# EAGLE design flatsat (EAGLE 7.2.0)
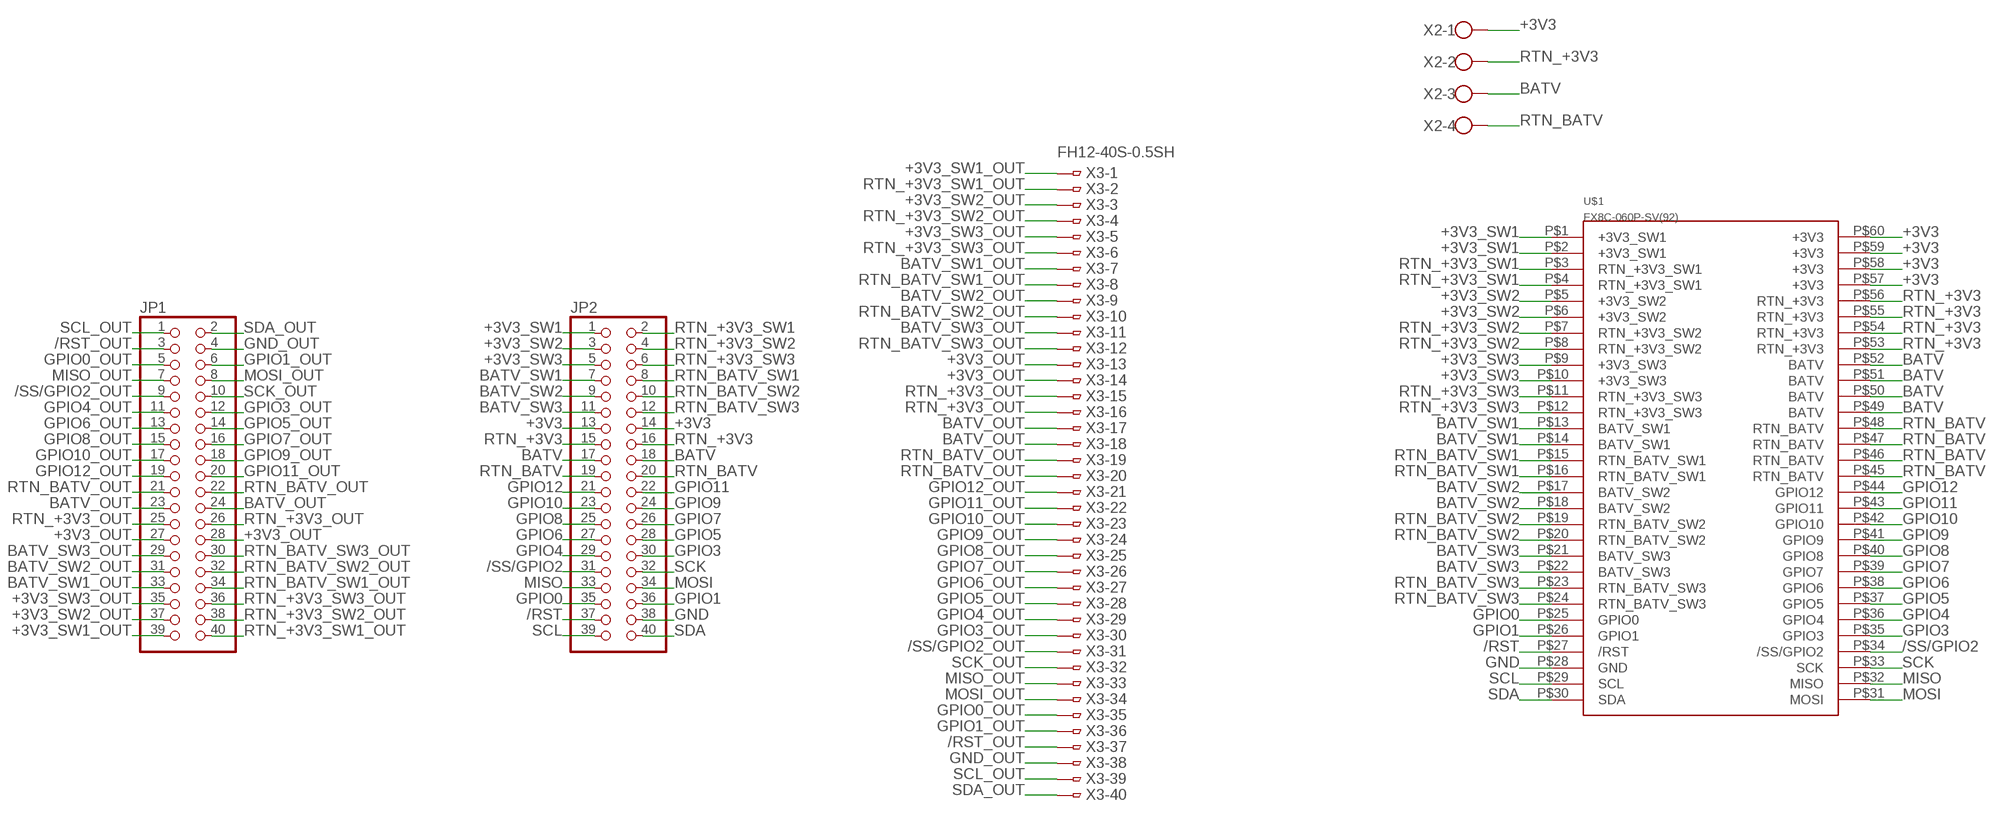
[diagram p0: schematic, sheet 1]

## Parts
JP1  PINHD-2X20/90  [2X20/90]
JP2  PINHD-2X20/90  [2X20/90]
U$1  FX8C-060P-SV(92)  [FX8C-060P-SV(92)]
X2  W237-4  [W237-4]
X3  FH12-40S-0.5SH  [FH12-40S-0.5SH]

## Nets
+3V3: JP2.13 JP2.14 U$1.P$57(+3V3) U$1.P$58(+3V3) U$1.P$59(+3V3) U$1.P$60(+3V3) X2.1
+3V3_OUT: JP1.27 JP1.28 X3.13 X3.14
+3V3_SW1: JP2.1 U$1.P$1(+3V3_SW1) U$1.P$2(+3V3_SW1)
+3V3_SW1_OUT: JP1.39 X3.1
+3V3_SW2: JP2.3 U$1.P$5(+3V3_SW2) U$1.P$6(+3V3_SW2)
+3V3_SW2_OUT: JP1.37 X3.3
+3V3_SW3: JP2.5 U$1.P$9(+3V3_SW3) U$1.P$10(+3V3_SW3)
+3V3_SW3_OUT: JP1.35 X3.5
/RST: JP2.37 U$1.P$27(/RST)
/RST_OUT: JP1.3 X3.37
/SS/GPIO2: JP2.31 U$1.P$34(/SS/GPIO2)
/SS/GPIO2_OUT: JP1.9 X3.31
BATV: JP2.17 JP2.18 U$1.P$49(BATV) U$1.P$50(BATV) U$1.P$51(BATV) U$1.P$52(BATV) X2.3
BATV_OUT: JP1.23 JP1.24 X3.17 X3.18
BATV_SW1: JP2.7 U$1.P$13(BATV_SW1) U$1.P$14(BATV_SW1)
BATV_SW1_OUT: JP1.33 X3.7
BATV_SW2: JP2.9 U$1.P$17(BATV_SW2) U$1.P$18(BATV_SW2)
BATV_SW2_OUT: JP1.31 X3.9
BATV_SW3: JP2.11 U$1.P$21(BATV_SW3) U$1.P$22(BATV_SW3)
BATV_SW3_OUT: JP1.29 X3.11
GND: JP2.38 U$1.P$28(GND)
GND_OUT: JP1.4 X3.38
GPIO0: JP2.35 U$1.P$25(GPIO0)
GPIO0_OUT: JP1.5 X3.35
GPIO1: JP2.36 U$1.P$26(GPIO1)
GPIO1_OUT: JP1.6 X3.36
GPIO3: JP2.30 U$1.P$35(GPIO3)
GPIO3_OUT: JP1.12 X3.30
GPIO4: JP2.29 U$1.P$36(GPIO4)
GPIO4_OUT: JP1.11 X3.29
GPIO5: JP2.28 U$1.P$37(GPIO5)
GPIO5_OUT: JP1.14 X3.28
GPIO6: JP2.27 U$1.P$38(GPIO6)
GPIO6_OUT: JP1.13 X3.27
GPIO7: JP2.26 U$1.P$39(GPIO7)
GPIO7_OUT: JP1.16 X3.26
GPIO8: JP2.25 U$1.P$40(GPIO8)
GPIO8_OUT: JP1.15 X3.25
GPIO9: JP2.24 U$1.P$41(GPIO9)
GPIO9_OUT: JP1.18 X3.24
GPIO10: JP2.23 U$1.P$42(GPIO10)
GPIO10_OUT: JP1.17 X3.23
GPIO11: JP2.22 U$1.P$43(GPIO11)
GPIO11_OUT: JP1.20 X3.22
GPIO12: JP2.21 U$1.P$44(GPIO12)
GPIO12_OUT: JP1.19 X3.21
MISO: JP2.33 U$1.P$32(MISO)
MISO_OUT: JP1.7 X3.33
MOSI: JP2.34 U$1.P$31(MOSI)
MOSI_OUT: JP1.8 X3.34
RTN_+3V3: JP2.15 JP2.16 U$1.P$53(RTN_+3V3) U$1.P$54(RTN_+3V3) U$1.P$55(RTN_+3V3) U$1.P$56(RTN_+3V3) X2.2
RTN_+3V3_OUT: JP1.25 JP1.26 X3.15 X3.16
RTN_+3V3_SW1: JP2.2 U$1.P$3(RTN_+3V3_SW1) U$1.P$4(RTN_+3V3_SW1)
RTN_+3V3_SW1_OUT: JP1.40 X3.2
RTN_+3V3_SW2: JP2.4 U$1.P$7(RTN_+3V3_SW2) U$1.P$8(RTN_+3V3_SW2)
RTN_+3V3_SW2_OUT: JP1.38 X3.4
RTN_+3V3_SW3: JP2.6 U$1.P$11(RTN_+3V3_SW3) U$1.P$12(RTN_+3V3_SW3)
RTN_+3V3_SW3_OUT: JP1.36 X3.6
RTN_BATV: JP2.19 JP2.20 U$1.P$45(RTN_BATV) U$1.P$46(RTN_BATV) U$1.P$47(RTN_BATV) U$1.P$48(RTN_BATV) X2.4
RTN_BATV_OUT: JP1.21 JP1.22 X3.19 X3.20
RTN_BATV_SW1: JP2.8 U$1.P$15(RTN_BATV_SW1) U$1.P$16(RTN_BATV_SW1)
RTN_BATV_SW1_OUT: JP1.34 X3.8
RTN_BATV_SW2: JP2.10 U$1.P$19(RTN_BATV_SW2) U$1.P$20(RTN_BATV_SW2)
RTN_BATV_SW2_OUT: JP1.32 X3.10
RTN_BATV_SW3: JP2.12 U$1.P$23(RTN_BATV_SW3) U$1.P$24(RTN_BATV_SW3)
RTN_BATV_SW3_OUT: JP1.30 X3.12
SCK: JP2.32 U$1.P$33(SCK)
SCK_OUT: JP1.10 X3.32
SCL: JP2.39 U$1.P$29(SCL)
SCL_OUT: JP1.1 X3.39
SDA: JP2.40 U$1.P$30(SDA)
SDA_OUT: JP1.2 X3.40

## Library data of the parts
JP1 JP2 = pinhead:PINHD-2X20: PIN HEADER
U$1 = Template:FX8C-060P-SV(92)
X2 = con-wago-500:W237-4: WAGO SCREW CLAMP; OC_FARNELL: unknown; OC_NEWARK: unknown
X3 = con-hirose:FH12-40S-0.5S: 0.5mm Pitch Connectors For FPC/FFC Source: Data sheet <http://www.hirose.co.jp/cataloge_hp/e58605370.pdf>; MPN: FH12-40S-0.5SH(55); OC_FARNELL: 1324556; OC_NEWARK: 34M6178

## Board
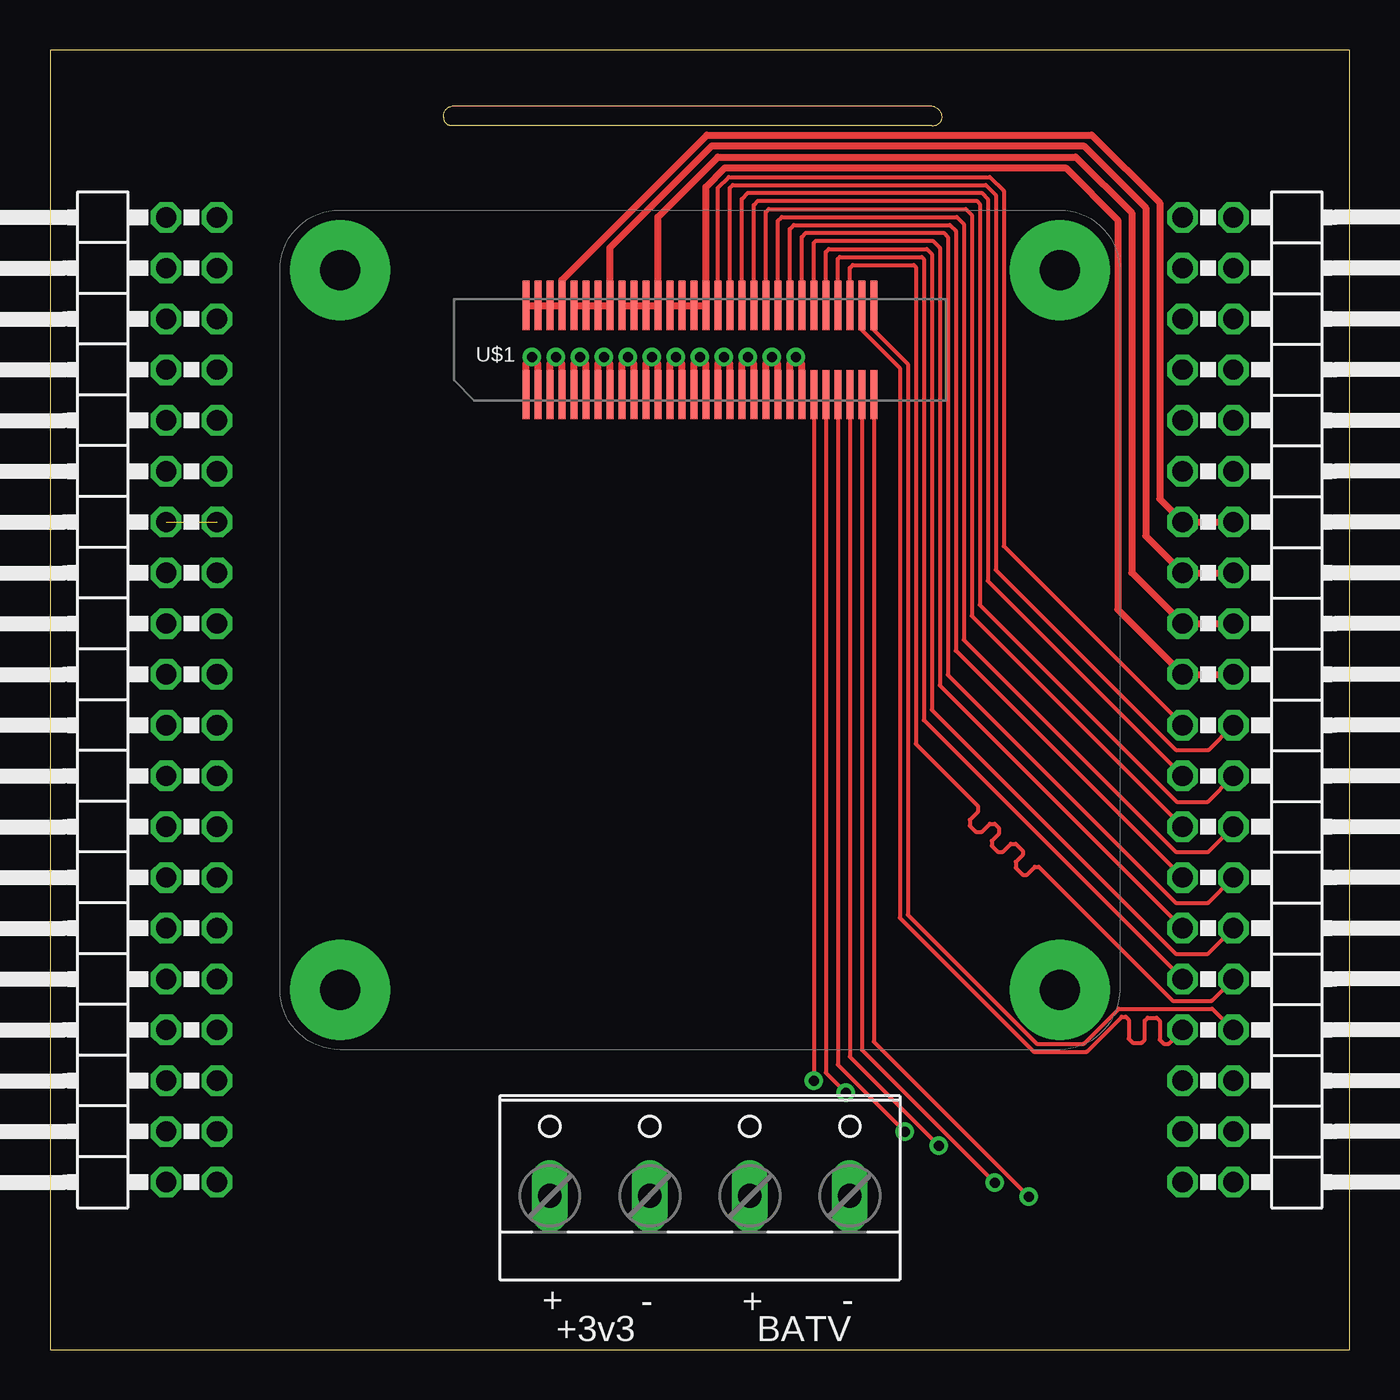
[diagram p1: board, top side]
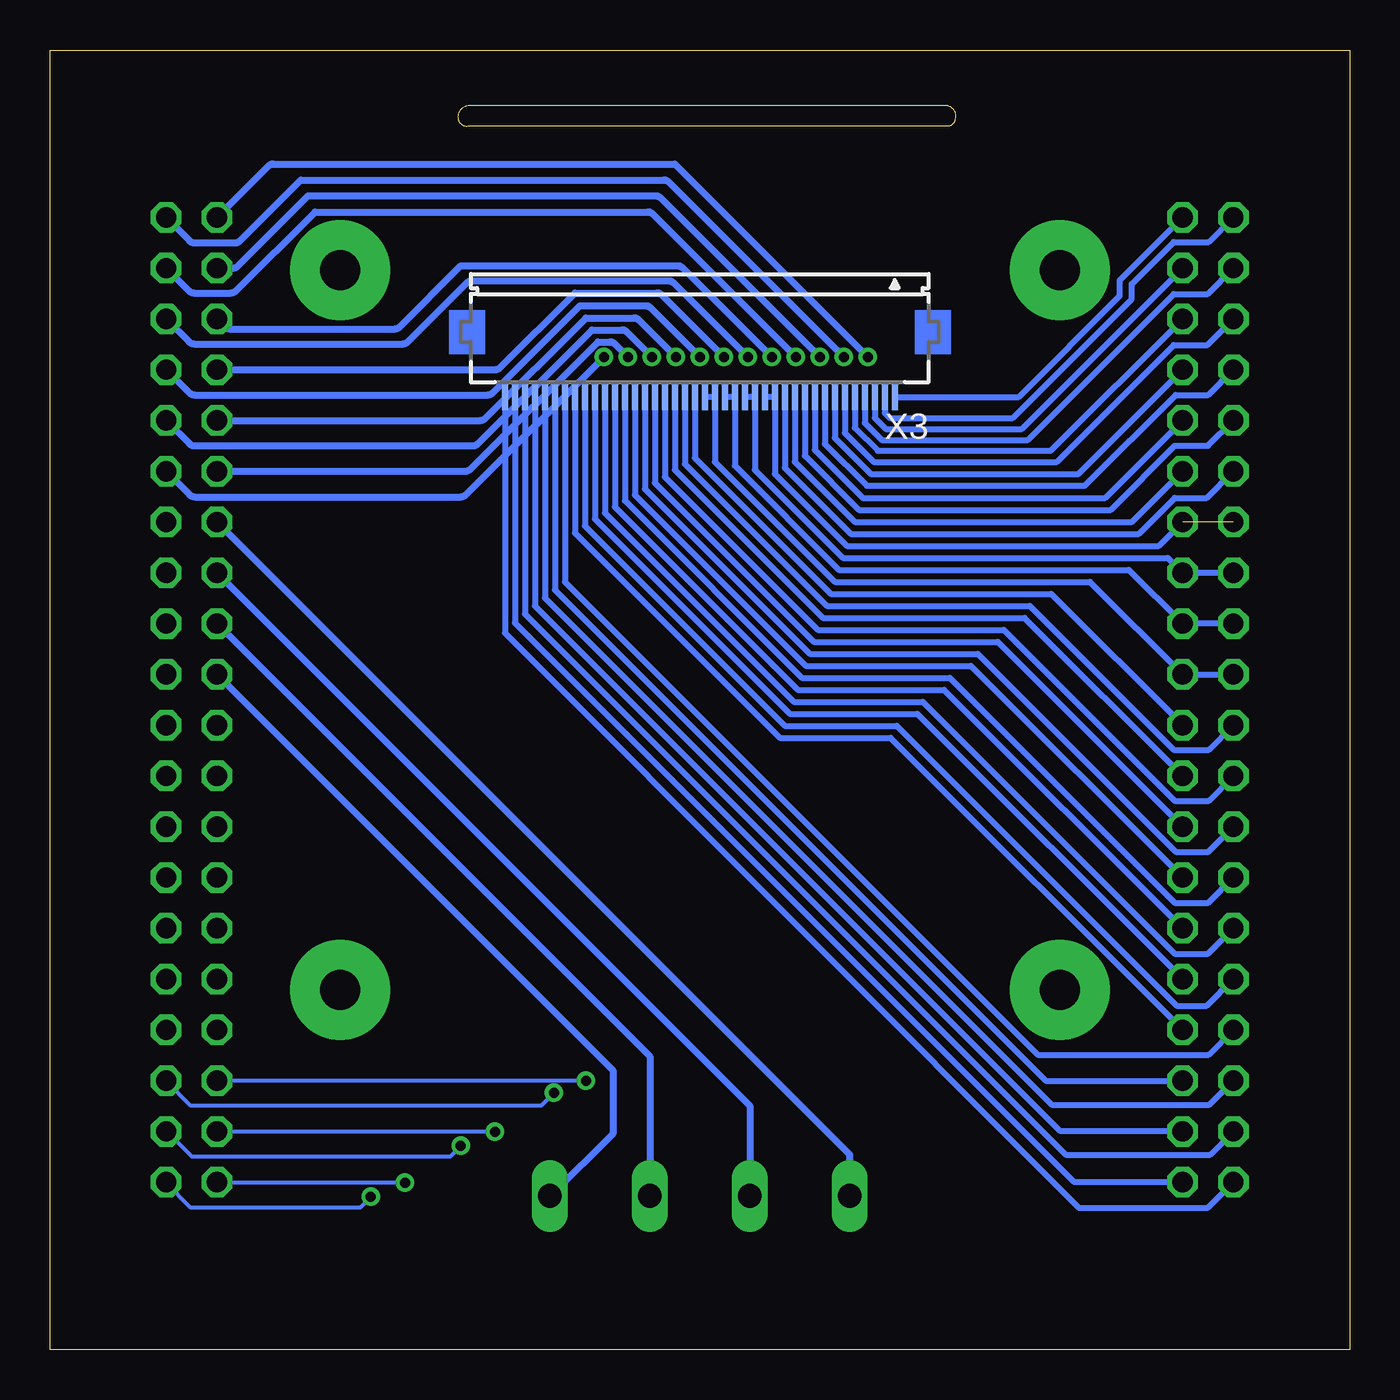
[diagram p2: board, bottom side, seen from below]

Size 65 x 65 mm. Coordinates in mm from the lower left corner, seen from the top.
Outline: 0,0 65,0 65,65 0,65 0,0
Outline: 19.7,61.6 arc-90 20.1,62.2 44.1,62.2 arc-90 44.6,61.6 arc-90 44.1,61.2 20.1,61.2 arc-90 19.7,61.6
Copper layers (1*16): Top 0.035mm / dielectric 1.5mm / Bottom 0.035mm
Design rules "default *": minimum track width 6mil, minimum drill 0.5mm, track to track 6mil, track to pad 6mil, pad to pad 6mil, via to via 6mil, smd to smd 6mil, copper to edge 6mil, drill to drill 6mil, minimum pad ring 10mil, minimum via ring 8mil, stop-mask expansion 4mil, vias tented up to drill 0mil, thermal gap 10mil

### Footprints (pad centres in the part's own frame; a part is rotated, then mirrored left to right if it is on the bottom)
2X20/90 = drill 1.016 octagon: 1 -24.13,-6.35; 2 -24.13,-3.81; 3 -21.59,-6.35; 4 -21.59,-3.81; 5 -19.05,-6.35; 6 -19.05,-3.81; 7 -16.51,-6.35; 8 -16.51,-3.81; 9 -13.97,-6.35; 10 -13.97,-3.81; 11 -11.43,-6.35; 12 -11.43,-3.81; 13 -8.89,-6.35; 14 -8.89,-3.81; 15 -6.35,-6.35; 16 -6.35,-3.81; 17 -3.81,-6.35; 18 -3.81,-3.81; 19 -1.27,-6.35; 20 -1.27,-3.81; 21 1.27,-6.35; 22 1.27,-3.81; 23 3.81,-6.35; 24 3.81,-3.81; 25 6.35,-6.35; 26 6.35,-3.81; 27 8.89,-6.35; 28 8.89,-3.81; 29 11.43,-6.35; 30 11.43,-3.81; 31 13.97,-6.35; 32 13.97,-3.81; 33 16.51,-6.35; 34 16.51,-3.81; 35 19.05,-6.35; 36 19.05,-3.81; 37 21.59,-6.35; 38 21.59,-3.81; 39 24.13,-6.35; 40 24.13,-3.81
FX8C-060P-SV(92) = smd 0.35 x 2.45: P$1 -8.7,-2.225; P$2 -8.1,-2.225; P$3 -7.5,-2.225; P$4 -6.9,-2.225; P$5 -6.3,-2.225; P$6 -5.7,-2.225; P$7 -5.1,-2.225; P$8 -4.5,-2.225; P$9 -3.9,-2.225; P$10 -3.3,-2.225; P$11 -2.7,-2.225; P$12 -2.1,-2.225; P$13 -1.5,-2.225; P$14 -0.9,-2.225; P$15 -0.3,-2.225; P$16 0.3,-2.225; P$17 0.9,-2.225; P$18 1.5,-2.225; P$19 2.1,-2.225; P$20 2.7,-2.225; P$21 3.3,-2.225; P$22 3.9,-2.225; P$23 4.5,-2.225; P$24 5.1,-2.225; P$25 5.7,-2.225; P$26 6.3,-2.225; P$27 6.9,-2.225; P$28 7.5,-2.225; P$29 8.1,-2.225; P$30 8.7,-2.225; P$31 8.7,2.225; P$32 8.1,2.225; P$33 7.5,2.225; P$34 6.9,2.225; P$35 6.3,2.225; P$36 5.7,2.225; P$37 5.1,2.225; P$38 4.5,2.225; P$39 3.9,2.225; P$40 3.3,2.225; P$41 2.7,2.225; P$42 2.1,2.225; P$43 1.5,2.225; P$44 0.9,2.225; P$45 0.3,2.225; P$46 -0.3,2.225; P$47 -0.9,2.225; P$48 -1.5,2.225; P$49 -2.1,2.225; P$50 -2.7,2.225; P$51 -3.3,2.225; P$52 -3.9,2.225; P$53 -4.5,2.225; P$54 -5.1,2.225; P$55 -5.7,2.225; P$56 -6.3,2.225; P$57 -6.9,2.225; P$58 -7.5,2.225; P$59 -8.1,2.225; P$60 -8.7,2.225
W237-4 = drill 1.194 long: 1 -7.5,-1.27; 2 -2.5,-1.27; 3 2.5,-1.27; 4 7.5,-1.27
FH12-40S-0.5SH = smd 0.3 x 1.3: 1 -9.75,3.25; 2 -9.25,3.25; 3 -8.75,3.25; 4 -8.25,3.25; 5 -7.75,3.25; 6 -7.25,3.25; 7 -6.75,3.25; 8 -6.25,3.25; 9 -5.75,3.25; 10 -5.25,3.25; 11 -4.75,3.25; 12 -4.25,3.25; 13 -3.75,3.25; 14 -3.25,3.25; 15 -2.75,3.25; 16 -2.25,3.25; 17 -1.75,3.25; 18 -1.25,3.25; 19 -0.75,3.25; 20 -0.25,3.25; 21 0.25,3.25; 22 0.75,3.25; 23 1.25,3.25; 24 1.75,3.25; 25 2.25,3.25; 26 2.75,3.25; 27 3.25,3.25; 28 3.75,3.25; 29 4.25,3.25; 30 4.75,3.25; 31 5.25,3.25; 32 5.75,3.25; 33 6.25,3.25; 34 6.75,3.25; 35 7.25,3.25; 36 7.75,3.25; 37 8.25,3.25; 38 8.75,3.25; 39 9.25,3.25; 40 9.75,3.25

### Placement (x,y rotation side)
JP1  2,32.5 90 top
JP2  63,32.5 270 top
U$1  32.5,50 0 top
X2  32.5,8.95 0 top
X3  32.5,50.9 180 bottom

### Tracks (layer width: path | path; a pad name or v marks a point on that pad's centre or on a via)
+3V3
  Top 0.35: U$1.P$60 U$1.P$59 U$1.P$58 U$1.P$57 25.6,53.5 32.85,60.75 52.1,60.75 55.5,57.35 55.5,42.54 JP2.13 JP2.14
  Bottom 0.35: X2.1 25,9.74 JP2.13
+3V3_OUT  (1 unrouted)
  Bottom 0.3: JP1.27 9.54,40.2 25.15,40.2 28.75,43.8 X3.13 X3.14
+3V3_SW1  (via drill 0.5)
  Top 0.35: U$1.P$1 23.8,49.2 arc-45 23.9,49.45 v24.1,49.65 24.3,49.45 arc-45 24.4,49.2 U$1.P$2
  Bottom 0.35: JP2.1 54.08,59.2 arc45 53.84,59.3 33.75,59.3 v24.1,49.65
+3V3_SW1_OUT
  Bottom 0.3: X3.1 16.55,47.65 11.5,52.7 11.5,53.48 JP1.39
+3V3_SW2  (via drill 0.5)
  Top 0.35: U$1.P$5 26.2,49.2 arc-45 26.3,49.45 v26.5,49.65 26.7,49.45 arc-45 26.8,49.2 U$1.P$6
  Bottom 0.35: JP2.3 55.85,54.09 arc-45 55.61,54.19 52.1,57.7 34.7,57.7 arc45 34.45,57.6 v26.5,49.65
+3V3_SW2_OUT
  Bottom 0.3: X3.3 23.75,46.6 23.2,46.05 16.39,46.05 JP1.37
+3V3_SW3  (via drill 0.5)
  Top 0.35: U$1.P$9 28.6,49.2 arc-45 28.7,49.45 v28.9,49.65 29.1,49.45 arc-45 29.2,49.2 U$1.P$10
  Bottom 0.35: JP2.5 56.25,51.15 arc-45 56.01,51.05 47.74,51.05 arc-45 47.5,51.15 44.45,54.2 33.59,54.2 arc45 33.35,54.1 v28.9,49.65
+3V3_SW3_OUT
  Bottom 0.3: X3.5 24.75,46.1 23.6,44.95 14.95,44.95 JP1.35
/RST  (via drill 0.5 pad 0.3)
  Top 0.2: U$1.P$27 39.4,14.25 v42.75,10.9
  Bottom 0.2: v42.75,10.9 JP2.37
/RST_OUT
  Bottom 0.3: X3.37 40.75,37.2 14.5,10.95 8.39,10.95 JP1.3
/SS/GPIO2
  Top 0.2: U$1.P$34 39.4,54.55 39.5,54.65 43.6,54.65 43.7,54.55 43.7,31.48 JP2.31
/SS/GPIO2_OUT
  Bottom 0.3: X3.31 37.75,41.55 28,31.8 21.62,31.8 JP1.9
BATV
  Top 0.35: U$1.P$52 U$1.P$51 U$1.P$50 U$1.P$49 30.4,56.65 33.4,59.65 51.3,59.65 54.1,56.85 54.1,38.85 JP2.17 JP2.18
  Bottom 0.35: JP2.17 35,14.66 X2.3
BATV_OUT
  Bottom 0.3: X3.18 X3.17 30.75,44.2 25.55,39 11.04,39 JP1.23 JP1.24
BATV_SW1  (via drill 0.5)
  Top 0.35: U$1.P$13 31,49.2 arc-45 31.1,49.45 v31.3,49.65 31.5,49.45 arc-45 31.6,49.2 U$1.P$14
  Bottom 0.35: JP2.7 42.73,49.01 arc-45 42.49,49.11 38.75,52.85 34.65,52.85 arc45 34.4,52.75 v31.3,49.65
BATV_SW1_OUT
  Bottom 0.3: X3.7 25.75,45.6 23.95,43.8 13.56,43.8 JP1.33
BATV_SW2  (via drill 0.5)
  Top 0.35: U$1.P$17 33.4,49.2 arc-45 33.5,49.45 v33.7,49.65 33.9,49.45 arc-45 34,49.2 U$1.P$18
  Bottom 0.35: JP2.9 43.48,46.47 arc-45 43.23,46.57 38.2,51.6 35.8,51.6 arc45 35.55,51.5 v33.7,49.65
BATV_SW2_OUT
  Bottom 0.3: X3.9 26.75,45 24.35,42.6 12.22,42.6 JP1.31
BATV_SW3  (via drill 0.5)
  Top 0.35: U$1.P$21 35.8,49.2 arc-45 35.9,49.45 v36.1,49.65 36.3,49.45 arc-45 36.4,49.2 U$1.P$22
  Bottom 0.35: JP2.11 44.22,43.93 arc-45 43.97,44.03 37.6,50.4 36.99,50.4 arc45 36.75,50.3 v36.1,49.65
BATV_SW3_OUT
  Bottom 0.3: X3.11 27.75,44.4 24.75,41.4 10.88,41.4 JP1.29
GND  (via drill 0.5 pad 0.3)
  Top 0.2: U$1.P$28 40,14.65 v44.45,10.2
  Bottom 0.2: v44.45,10.2 45,9.65 57.9,9.65 59.16,10.91 JP2.38
GND_OUT
  Bottom 0.3: X3.38 41.25,36.8 14.2,9.75 6.97,9.75 JP1.4
GPIO0  (via drill 0.5 pad 0.3)
  Top 0.2: U$1.P$25 v38.2,13.45
  Bottom 0.2: v38.2,13.45 JP2.35
GPIO0_OUT
  Bottom 0.3: X3.35 39.75,38 15.2,13.45 JP1.5
GPIO1  (via drill 0.5 pad 0.3)
  Top 0.2: U$1.P$26 38.8,13.85 v39.8,12.85
  Bottom 0.2: v39.8,12.85 40.45,12.2 57.95,12.2 JP2.36
GPIO1_OUT
  Bottom 0.3: X3.36 40.25,37.6 14.9,12.25 7.01,12.25 JP1.6
GPIO3
  Top 0.2: U$1.P$35 38.8,54.9 38.95,55.05 43.85,55.05 44.1,54.8 44.1,32 56.3,19.8 57.92,19.8 JP2.30
GPIO3_OUT
  Bottom 0.3: X3.30 37.25,41.85 27.8,32.4 21.35,32.4 8.75,19.8 7.08,19.8 JP1.12
GPIO4
  Top 0.2: U$1.P$36 38.2,55.35 38.3,55.45 44.15,55.45 44.5,55.1 44.5,33.22 JP2.29
GPIO4_OUT
  Bottom 0.3: X3.29 36.75,42.15 27.6,33 20.28,33 JP1.11
GPIO5
  Top 0.2: U$1.P$37 37.6,55.65 37.8,55.85 44.7,55.85 44.9,55.65 44.9,33.75 56.3,22.35 57.93,22.35 JP2.28
GPIO5_OUT
  Bottom 0.3: X3.28 36.25,42.45 27.4,33.6 20,33.6 8.75,22.35 7.07,22.35 JP1.14
GPIO6
  Top 0.2: U$1.P$38 37,56.05 37.2,56.25 45,56.25 45.3,55.95 45.3,34.96 JP2.27
GPIO6_OUT
  Bottom 0.3: X3.27 35.75,42.75 27.2,34.2 18.94,34.2 JP1.13
GPIO7
  Top 0.2: U$1.P$39 36.4,56.45 36.6,56.65 45.35,56.65 45.7,56.3 45.7,35.5 56.3,24.9 57.94,24.9 JP2.26
GPIO7_OUT
  Bottom 0.3: X3.26 35.25,43.05 27,34.8 18.6,34.8 8.7,24.9 7.06,24.9 JP1.16
GPIO8
  Top 0.2: U$1.P$40 35.8,56.9 35.95,57.05 45.8,57.05 46.1,56.75 46.1,36.7 JP2.25
GPIO8_OUT
  Bottom 0.3: X3.25 34.75,43.35 26.8,35.4 17.6,35.4 JP1.15
GPIO9
  Top 0.2: U$1.P$41 35.2,57.25 35.4,57.45 46.35,57.45 46.5,57.3 46.5,37.25 56.35,27.4 57.9,27.4 JP2.24
GPIO9_OUT
  Bottom 0.3: X3.24 34.25,43.65 26.6,36 17.3,36 8.75,27.45 7.05,27.45 JP1.18
GPIO10
  Top 0.2: U$1.P$42 34.6,57.55 34.9,57.85 46.6,57.85 46.9,57.55 46.9,38.44 JP2.23
GPIO10_OUT
  Bottom 0.3: X3.23 33.75,44 26.35,36.6 16.26,36.6 JP1.17
GPIO11
  Top 0.2: U$1.P$43 34,58.1 34.15,58.25 46.8,58.25 47.3,57.75 47.3,39 56.3,30 57.96,30 JP2.22
GPIO11_OUT
  Bottom 0.3: X3.22 33.25,44.3 26.15,37.2 16,37.2 8.8,30 7.04,30 JP1.20
GPIO12
  Top 0.2: U$1.P$44 33.4,58.1 33.95,58.65 47,58.65 47.7,57.95 47.7,40.18 JP2.21
GPIO12_OUT
  Bottom 0.3: X3.21 32.75,44.6 25.95,37.8 14.92,37.8 JP1.19
MISO
  Top 0.2: U$1.P$32 40.6,51 42.5,49.1 42.5,21.6 49.2,14.9 51.85,14.9 53.6,16.65 53.8,16.65 53.95,16.5 53.95,15.55 54.15,15.35 54.6,15.35 54.75,15.5 54.75,16.45 54.9,16.6 55.35,16.6 55.5,16.45 55.5,15.5 55.7,15.3 55.96,15.3 JP2.33
MISO_OUT
  Bottom 0.3: X3.33 38.75,40.85 28.5,30.6 22.96,30.6 JP1.7
MOSI
  Top 0.2: U$1.P$31 41.2,51 42.9,49.3 42.9,21.75 49.35,15.3 51.7,15.3 53.45,17.05 58.13,17.05 JP2.34
MOSI_OUT
  Bottom 0.3: X3.34 39.25,38.4 15.6,14.75 7.05,14.75 JP1.8
N$1  (via drill 2 pad 5)
  other vias: 14.5,54
N$2  (via drill 2 pad 5)
  other vias: 50.5,54
N$3  (via drill 2 pad 5)
  other vias: 50.5,18
N$4  (via drill 2 pad 5)
  other vias: 14.5,18
RTN_+3V3
  Top 0.35: U$1.P$56 U$1.P$55 U$1.P$54 U$1.P$53 28,55.1 33.1,60.2 51.7,60.2 54.8,57.1 54.8,40.7 JP2.15 JP2.16
  Bottom 0.35: JP2.15 30,12.2 X2.2
RTN_+3V3_OUT
  Bottom 0.3: X3.16 X3.15 29.75,44 25.35,39.6 9.1,39.6 JP1.25 JP1.26
RTN_+3V3_SW1  (via drill 0.5)
  Top 0.35: U$1.P$3 25,49.2 arc-45 25.1,49.45 v25.3,49.65 25.5,49.45 arc-45 25.6,49.2 U$1.P$4
  Bottom 0.35: JP2.2 58.01,55.45 arc-45 57.77,55.35 55.74,55.35 arc-45 55.5,55.45 52.45,58.5 34.3,58.5 arc45 34.05,58.4 v25.3,49.65
RTN_+3V3_SW1_OUT
  Bottom 0.3: X3.2 23.25,46.85 23,46.6 16.85,46.6 10.9,52.55 10.9,53.3 8.8,55.4 7.04,55.4 JP1.40
RTN_+3V3_SW2  (via drill 0.5)
  Top 0.35: U$1.P$7 27.4,49.2 arc-45 27.5,49.45 v27.7,49.65 27.9,49.45 arc-45 28,49.2 U$1.P$8
  Bottom 0.35: JP2.4 58.05,52.95 arc-45 57.8,52.85 55.95,52.85 arc-45 55.7,52.95 51.75,56.9 35.09,56.9 arc45 34.85,56.8 v27.7,49.65
RTN_+3V3_SW2_OUT
  Bottom 0.3: X3.4 24.25,46.35 23.4,45.5 16.1,45.5 8.8,52.8 7.1,52.8 JP1.38
RTN_+3V3_SW3  (via drill 0.5)
  Top 0.35: U$1.P$11 29.8,49.2 arc-45 29.9,49.45 v30.1,49.65 30.3,49.45 arc-45 30.4,49.2 U$1.P$12
  Bottom 0.35: JP2.6 58.04,50.4 arc-45 57.8,50.3 47.34,50.3 arc-45 47.1,50.4 44.15,53.35 arc45 43.91,53.45 34.05,53.45 arc45 33.8,53.35 v30.1,49.65
RTN_+3V3_SW3_OUT
  Bottom 0.3: X3.6 25.25,45.85 23.8,44.4 14.65,44.4 8.8,50.25 7.11,50.25 JP1.36
RTN_BATV
  Top 0.35: U$1.P$48 U$1.P$47 U$1.P$46 U$1.P$45 32.8,58.15 33.75,59.1 50.8,59.1 53.4,56.5 53.4,37.02 JP2.19 JP2.20
  Bottom 0.35: JP2.19 36.85,13.97 36.85,10.8 39.97,7.68 X2.4
RTN_BATV_OUT
  Bottom 0.3: X3.20 X3.19 31.75,44.4 25.75,38.4 12.98,38.4 JP1.21 JP1.22
RTN_BATV_SW1  (via drill 0.5)
  Top 0.35: U$1.P$15 32.2,49.2 arc-45 32.3,49.45 v32.5,49.65 32.7,49.45 arc-45 32.8,49.2 U$1.P$16
  Bottom 0.35: JP2.8 58.03,47.85 arc-45 57.78,47.75 43.09,47.75 arc-45 42.85,47.85 38.5,52.2 35.2,52.2 arc45 34.95,52.1 v32.5,49.65
RTN_BATV_SW1_OUT
  Bottom 0.3: X3.8 26.25,45.3 24.15,43.2 13.25,43.2 8.7,47.75 7.07,47.75 JP1.34
RTN_BATV_SW2  (via drill 0.5)
  Top 0.35: U$1.P$19 34.6,49.2 arc-45 34.7,49.45 v34.9,49.65 35.1,49.45 arc-45 35.2,49.2 U$1.P$20
  Bottom 0.35: JP2.10 58.02,45.3 arc-45 57.77,45.2 43.84,45.2 arc-45 43.6,45.3 37.9,51 36.4,51 arc45 36.15,50.9 v34.9,49.65
RTN_BATV_SW2_OUT
  Bottom 0.3: X3.10 27.25,44.7 24.55,42 11.95,42 8.75,45.2 7.08,45.2 JP1.32
RTN_BATV_SW3  (via drill 0.5)
  Top 0.35: U$1.P$23 37,49.2 arc-45 37.1,49.45 v37.3,49.65 37.5,49.45 arc-45 37.6,49.2 U$1.P$24
  Bottom 0.35: JP2.12 58.01,42.75 arc-45 57.77,42.65 44.45,42.65 arc-45 44.2,42.75 v37.3,49.65
RTN_BATV_SW3_OUT
  Bottom 0.3: X3.12 28.25,44.1 24.95,40.8 10.55,40.8 8.75,42.6 7.14,42.6 JP1.30
SCK
  Top 0.2: U$1.P$33 40,54.1 40.15,54.25 43.2,54.25 43.3,54.15 43.3,30.3 46.4,27.2 46.4,26.9 46,26.5 46,26.2 46.3,25.9 46.6,25.9 47,26.3 47.25,26.3 47.45,26.1 47.45,25.8 47.1,25.45 47.1,25.2 47.4,24.9 47.65,24.9 48.05,25.3 48.3,25.3 48.65,24.95 48.65,24.75 48.3,24.4 48.3,24.1 48.65,23.75 48.85,23.75 49.25,24.15 49.45,24.15 56.15,17.45 58.11,17.45 JP2.32
SCK_OUT
  Bottom 0.3: X3.32 38.25,41.2 28.25,31.2 22.65,31.2 8.65,17.2 7.14,17.2 JP1.10
SCL  (via drill 0.5 pad 0.3)
  Top 0.2: U$1.P$29 40.6,15 v47.25,8.35
  Bottom 0.2: v47.25,8.35 56.63,8.35 JP2.39
SCL_OUT
  Bottom 0.3: X3.39 41.75,36.35 13.8,8.4 8.38,8.4 JP1.1
SDA  (via drill 0.5 pad 0.3)
  Top 0.2: U$1.P$30 41.2,15.4 v48.95,7.65
  Bottom 0.2: v48.95,7.65 49.5,7.1 57.95,7.1 59.19,8.34 JP2.40
SDA_OUT
  Bottom 0.3: X3.40 42.25,35.85 13.55,7.1 7.08,7.1 JP1.2

### Text on the board
tNames: + | - | + | - | +3v3 | BATV